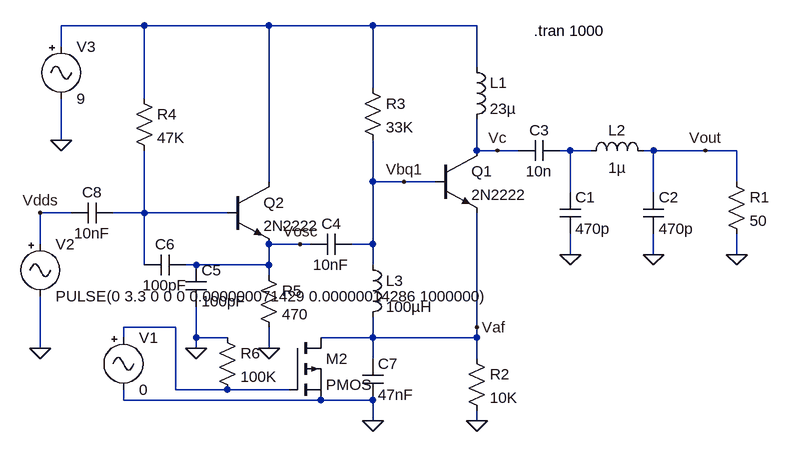
[diagram p0: schematic pixiepico.asc]
pixiepico.asc, the LTspice schematic file:
Version 4
SHEET 1 984 680
WIRE 16 0 -112 0
WIRE 208 0 16 0
WIRE 368 0 208 0
WIRE 528 0 368 0
WIRE -112 32 -112 0
WIRE 528 64 528 0
WIRE 368 96 368 0
WIRE 16 112 16 0
WIRE -112 176 -112 112
WIRE 528 192 528 144
WIRE 560 192 528 192
WIRE 592 192 560 192
WIRE 672 192 656 192
WIRE 704 192 672 192
WIRE 800 192 784 192
WIRE 880 192 800 192
WIRE 928 192 880 192
WIRE 208 240 208 0
WIRE 368 240 368 176
WIRE 416 240 368 240
WIRE 464 240 416 240
WIRE 928 240 928 192
WIRE 672 256 672 192
WIRE 800 256 800 192
WIRE -96 288 -144 288
WIRE 16 288 16 192
WIRE 16 288 -32 288
WIRE 144 288 16 288
WIRE -144 336 -144 288
WIRE 256 336 208 336
WIRE 272 336 256 336
WIRE 368 336 368 240
WIRE 368 336 336 336
WIRE 672 352 672 320
WIRE 800 352 800 320
WIRE 928 352 928 320
WIRE 16 368 16 288
WIRE 96 368 80 368
WIRE 208 368 208 336
WIRE 208 368 96 368
WIRE 368 368 368 336
WIRE 208 384 208 368
WIRE 64 464 -16 464
WIRE 528 464 528 288
WIRE -16 480 -16 464
WIRE 96 480 96 432
WIRE 144 480 96 480
WIRE 368 480 368 448
WIRE 368 480 288 480
WIRE 528 480 528 464
WIRE 528 480 368 480
WIRE -144 496 -144 416
WIRE 96 496 96 480
WIRE 208 496 208 464
WIRE 368 512 368 480
WIRE 528 512 528 480
WIRE 64 560 64 464
WIRE 144 560 64 560
WIRE 240 560 144 560
WIRE -16 576 -16 560
WIRE 288 576 -16 576
WIRE 368 576 288 576
WIRE 368 608 368 576
WIRE 528 608 528 592
FLAG 208 496 0
FLAG 528 608 0
FLAG 672 352 0
FLAG 800 352 0
FLAG 928 352 0
FLAG 96 496 0
FLAG 368 608 0
FLAG -144 496 0
FLAG 256 336 Vosc
FLAG 880 192 Vout
FLAG -144 288 Vdds
FLAG 528 464 Vaf
FLAG -112 176 0
FLAG 560 192 Vc
FLAG 416 240 Vbq1
SYMBOL npn 464 192 R0
SYMATTR InstName Q1
SYMATTR Value 2N2222
SYMBOL npn 144 240 R0
SYMATTR InstName Q2
SYMATTR Value 2N2222
SYMBOL ind 512 48 R0
SYMATTR InstName L1
SYMATTR Value 23µ
SYMBOL ind 688 208 R270
WINDOW 0 32 56 VTop 2
WINDOW 3 5 56 VBottom 2
SYMATTR InstName L2
SYMATTR Value 1µ
SYMBOL Cap 656 256 R0
SYMATTR InstName C1
SYMATTR Value 470p
SYMBOL Cap 784 256 R0
SYMATTR InstName C2
SYMATTR Value 470p
SYMBOL Cap 656 176 R90
WINDOW 0 0 32 VBottom 2
WINDOW 3 32 32 VTop 2
SYMATTR InstName C3
SYMATTR Value 10n
SYMBOL Res 912 224 R0
SYMATTR InstName R1
SYMATTR Value 50
SYMBOL Res 352 80 R0
SYMATTR InstName R3
SYMATTR Value 33K
SYMBOL ind 352 352 R0
SYMATTR InstName L3
SYMATTR Value 100µH
SYMBOL Res 512 496 R0
SYMATTR InstName R2
SYMATTR Value 10K
SYMBOL Cap 336 320 R90
WINDOW 0 0 32 VBottom 2
WINDOW 3 32 32 VTop 2
SYMATTR InstName C4
SYMATTR Value 10nF
SYMBOL Res 0 96 R0
SYMATTR InstName R4
SYMATTR Value 47K
SYMBOL Res 192 368 R0
SYMATTR InstName R5
SYMATTR Value 470
SYMBOL Cap 80 368 R0
SYMATTR InstName C5
SYMATTR Value 100pF
SYMBOL Cap 80 352 R90
WINDOW 0 0 32 VBottom 2
WINDOW 3 32 32 VTop 2
SYMATTR InstName C6
SYMATTR Value 100pF
SYMBOL Cap 352 512 R0
SYMATTR InstName C7
SYMATTR Value 47nF
SYMBOL Misc/signal -144 320 R0
SYMATTR InstName V2
SYMATTR Value PULSE(0 3.3 0 0 0 0.000000071429 0.00000014286 1000000)
SYMATTR Value2 AC 3.3 0
SYMBOL Misc/signal -112 16 R0
SYMATTR InstName V3
SYMATTR Value 9
SYMBOL Cap -32 272 R90
WINDOW 0 0 32 VBottom 2
WINDOW 3 32 32 VTop 2
SYMATTR InstName C8
SYMATTR Value 10nF
SYMBOL Res 128 464 R0
SYMATTR InstName R6
SYMATTR Value 100K
SYMBOL Misc/signal -16 464 R0
SYMATTR InstName V1
SYMATTR Value 0
SYMBOL pmos 240 480 R0
SYMATTR InstName M2
TEXT 616 8 Left 2 !.tran 1000

The netlist it stands for:
* pixiepico.asc
Q1 Vc Vbq1 Vaf 0 2N2222
Q2 N001 N003 Vosc 0 2N2222
L1 N001 Vc 23µ
L2 N002 Vout 1µ
C1 N002 0 470p
C2 Vout 0 470p
C3 N002 Vc 10n
R1 Vout 0 50
R3 N001 Vbq1 33K
L3 Vbq1 Vaf 100µH
R2 Vaf 0 10K
C4 Vbq1 Vosc 10nF
R4 N001 N003 47K
R5 Vosc 0 470
C5 Vosc 0 100pF
C6 Vosc N003 100pF
C7 Vaf 0 47nF
V2 Vdds 0 PULSE(0 3.3 0 0 0 0.000000071429 0.00000014286 1000000) AC 3.3 0
V3 N001 0 9
C8 N003 Vdds 10nF
R6 0 N004 100K
V1 N004 0 0
M2 Vaf N004 0 0 PMOS
.model NPN NPN
.model PNP PNP
.lib standard.bjt
.model NMOS NMOS
.model PMOS PMOS
.lib standard.mos
.tran 1000
.backanno
.end